# Altium schematic sheet VoltageRegulators.SchDoc (part 1 of 3)
size A4
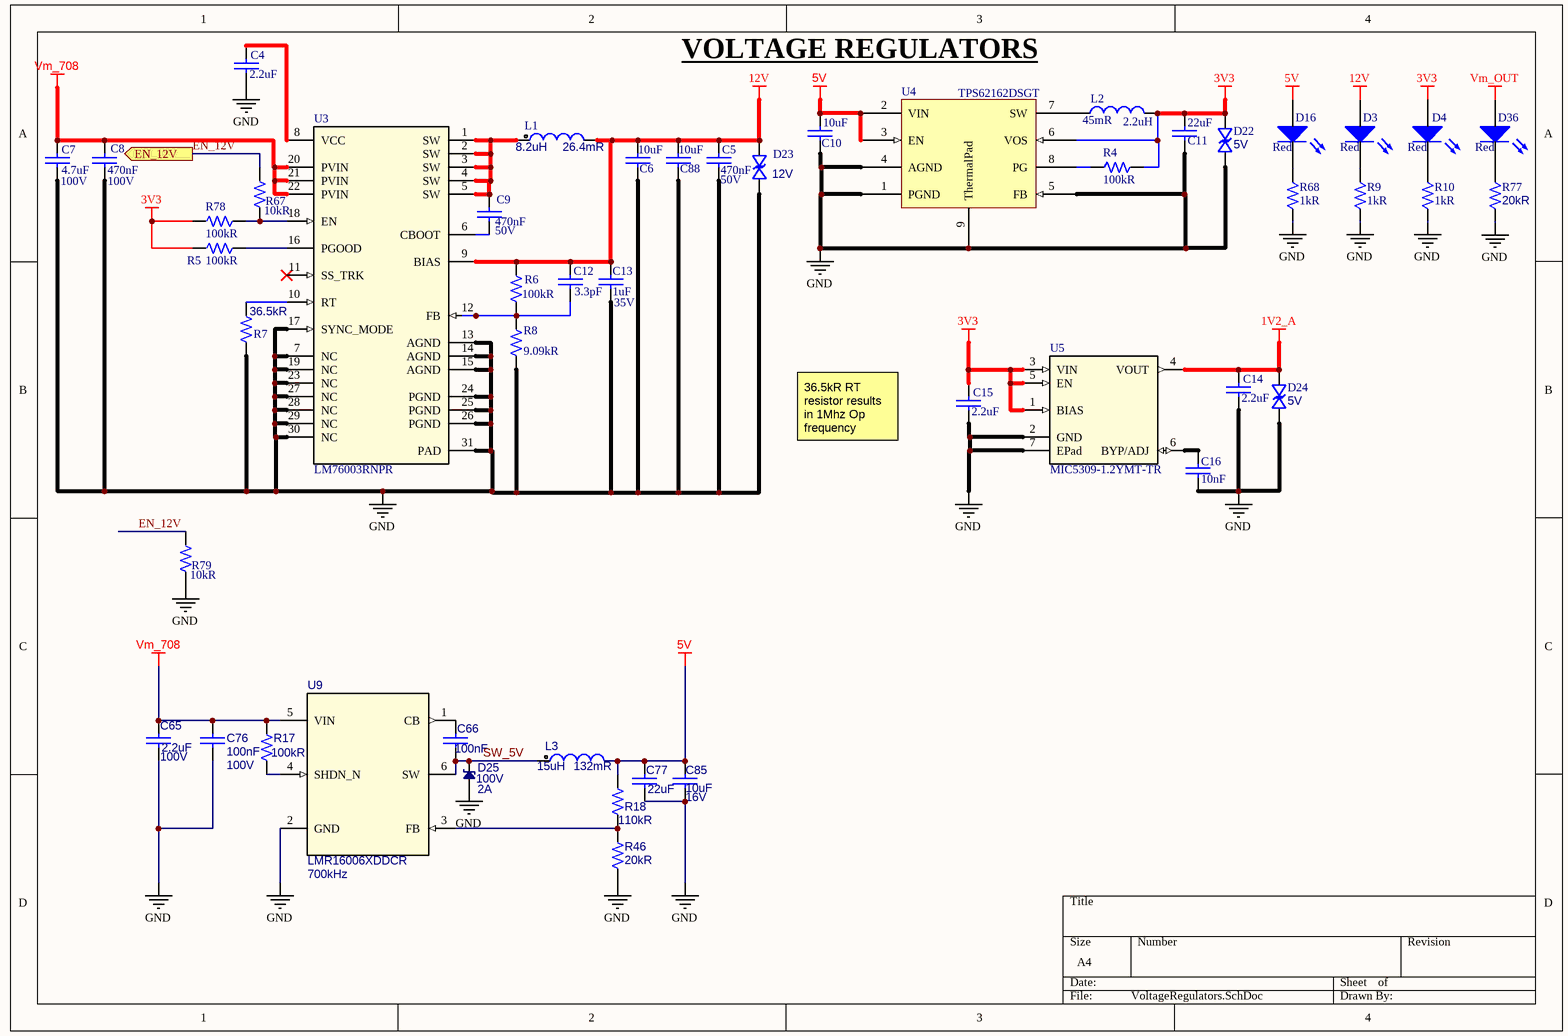
[diagram p0: VoltageRegulators.SchDoc]

## Parts
C4  Capacitance: 2.2uF  [CAP0402]  (hidden comment: Capacitor)
C5  Capacitance: 470nF  Voltage Rating: 50V  [CAP0603]  (hidden comment: Capacitor)
C6  value 10uF  [CAP0603]  (hidden comment: Capacitor)
C7  Capacitance: 4.7uF  Voltage Rating: 100V  [CAP1210]  (hidden comment: Capacitor)
C8  Capacitance: 470nF  Voltage Rating: 100V  [CAP0805]  (hidden comment: Capacitor)
C9  Capacitance: 470nF  Voltage Rating: 50V  [CAP0603]  (hidden comment: Capacitor)
C10  value 10uF  [CAP0603]  (hidden comment: Capacitor)
C11  value 22uF  [CAP0603]  (hidden comment: Capacitor)
C12  Capacitance: 3.3pF  [CAP0402]  (hidden comment: Capacitor)
C13  Voltage Rating: 35V  Capacitance: 1uF  [CAP0402]  (hidden comment: Capacitor)
C14  Capacitance: 2.2uF  [CAP0402]  (hidden comment: Capacitor)
C15  Capacitance: 2.2uF  [CAP0402]  (hidden comment: Capacitor)
C16  Capacitance: 10nF  [CAP0402]  (hidden comment: Capacitor)
C65  Capacitance: 2.2uF  Voltage Rating: 100V  [CAP1206]  (hidden comment: Capacitor)
C66  Capacitance: 100nF  [CAP0402]  (hidden comment: Capacitor)
C76  Capacitance: 100nF  Voltage Rating: 100V  [CAP0402]  (hidden comment: Capacitor)
C77  Capacitance: 22uF  [CAP0805]  (hidden comment: Capacitor)
C85  Capacitance: 10uF  Voltage Rating (DC): 16V  [CAP0603]  (hidden comment: Capacitor)
C88  value 10uF  [CAP0603]  (hidden comment: Capacitor)
D3  Colour: Red  [LED-0603-RED]  (hidden comment: LED)
D4  Colour: Red  [LED-0603-RED]  (hidden comment: LED)
D16  Colour: Red  [LED-0603-RED]  (hidden comment: LED)
D22  Reverse Standoff Voltage: 5V  [SLP1006P2T]  (hidden comment: TVS-Bidirectional)
D23  Working Voltage: 12V  [SLP1006P2T]  (hidden comment: TVS-Bidirectional)
D24  Reverse Standoff Voltage: 5V  [SLP1006P2T]  (hidden comment: TVS-Bidirectional)
D25  Max Reverse Voltage (DC): 100V  Average Rectified Current: 2A  [SOD-123F]  (hidden comment: Diode)
D36  Colour: Red  [LED-0603-RED]  (hidden comment: LED)
L1  Inductance: 8.2uH  DC Resistance (DCR): 26.4mR  [IND_ XAL6060-682MEB]  (hidden comment: Inductor)
L2  Inductance: 2.2uH  DC Resistance (DCR): 45mR  [IFSC-1515AH-ER2R2M01]  (hidden comment: Inductor)
L3  Inductance: 15uH  DC Resistance (DCR): 132mR  [IND_74404043---A]  (hidden comment: Inductor)
R4  Resistance: 100kR  [RES0402]  (hidden comment: Resistor)
R5  Resistance: 100kR  [RES0402]  (hidden comment: Resistor)
R6  Resistance: 100kR  [RES0402]  (hidden comment: Resistor)
R7  Resistance: 36.5kR  [RES0402]  (hidden comment: Resistor)
R8  Resistance: 9.09kR  [RES0402]  (hidden comment: Resistor)
R9  Resistance: 1kR  [RES0402]  (hidden comment: Resistor)
R10  Resistance: 1kR  [RES0402]  (hidden comment: Resistor)
R17  Resistance: 100kR  [RES0402]  (hidden comment: Resistor)
R18  Resistance: 110kR  [RES0402]  (hidden comment: Resistor)
R46  Resistance: 20kR  [RES0402]  (hidden comment: Resistor)
R67  Resistance: 10kR  [RES0402]  (hidden comment: Resistor)
R68  Resistance: 1kR  [RES0402]  (hidden comment: Resistor)
R77  Resistance: 20kR  [RES0603]  (hidden comment: Resistor)
R78  Resistance: 100kR  [RES0402]  (hidden comment: Resistor)
R79  Resistance: 10kR  [RES0402]  (hidden comment: Resistor)
U3  LM76003RNPR  [LM76003]
U4  Manufacturer Part Number 1: TPS62162DSGT  [TPS6216X]  (hidden comment: 3-17v Switching Reg)
U5  Manufacturer Part Number 1: MIC5309-1.2YMT-TR  [MIC5309]  (hidden comment: MIC5309-xx)
U9  Manufacturer Part Number 1: LMR16006XDDCR  Switching Frequency: 700kHz  [SOT23-6]  (hidden comment: IC REG BUCK ADJ 600MA TSOT23-6)

## Ports
EN_12V (out)

## Nets
1V2_A: C14.1 D24.1 U5.4(VOUT)
3V3: C11.1 C15.1 D4.2 D22.1 L2.2 R4.1 R5.2 R78.2 U4.6(VOS) U5.1(BIAS) U5.3(VIN) U5.5(EN)
5V: C10.1 C77.1 C85.1 D16.2 L3.2 R18.2 U4.2(VIN) U4.3(EN)
12V: C5.1 C6.1 C12.1 C13.2 C88.1 D3.2 D23.2 L1.2 R6.2 U3.9(BIAS)
GND: C4.2 C5.2 C6.2 C7.1 C8.2 C10.2 C11.2 C13.1 C14.2 C15.2 C16.2 C65.2 C76.2 C77.2 C85.2 C88.2 D22.2 D23.1 D24.2 D25.2 R7.1 R8.1 R9.1 R10.1 R46.1 R68.1 R77.1 R79.1 U3.7(NC) U3.13(AGND) U3.14(AGND) U3.15(AGND) U3.17(SYNC_MODE) U3.19(NC) U3.23(NC) U3.24(PGND) U3.25(PGND) U3.26(PGND) U3.27(NC) U3.28(NC) U3.29(NC) U3.30(NC) U3.31(PAD) U4.1(PGND) U4.4(AGND) U4.5(FB) U4.9(ThermalPad) U5.2(GND) U5.7(EPad) U9.2(GND)
Vm_708: C7.2 C8.1 C65.1 C76.1 R17.2 U3.20(PVIN) U3.21(PVIN) U3.22(PVIN) U9.5(VIN)
Vm_OUT: D36.2
EN_12V: R67.2 R79.2 ; port EN_12V
SW_5V: C66.2 D25.1 L3.1 U9.6(SW)
NetC4_1: C4.1 U3.8(VCC)
NetC9_1: C9.1 L1.1 U3.1(SW) U3.2(SW) U3.3(SW) U3.4(SW) U3.5(SW)
NetC9_2: C9.2 U3.6(CBOOT)
NetC12_2: C12.2 R6.1 R8.2 U3.12(FB)
NetC16_1: C16.1 U5.6(BYP/ADJ)
NetC66_1: C66.1 U9.1(CB)
NetD3_1: D3.1 R9.2
NetD4_1: D4.1 R10.2
NetD16_1: D16.1 R68.2
NetD36_1: D36.1 R77.2
NetL2_1: L2.1 U4.7(SW)
NetR4_2: R4.2 U4.8(PG)
NetR5_1: R5.1 U3.16(PGOOD)
NetR7_2: R7.2 U3.10(RT)
NetR17_1: R17.1 U9.4(SHDN_N)
NetR18_1: R18.1 R46.2 U9.3(FB)
NetR67_1: R67.1 R78.1 U3.18(EN)

Not connected (* = marked no-connect by the designer): U3 11(SS_TRK)*

## Notes on the sheet
- VOLTAGE REGULATORS
- 36.5kR RT resistor results in 1Mhz Op frequency